# EasyEDA Pro project FOX_HTOL_test_2.0.eprj

# Schematic Schematic1
Create Date: 2023-11-06; Page Name: P1; Project Name: FOX_HTOL_test_2.0; Schematic Name: Schematic1; Update Date: 2023-11-07; Company: 嘉立创EDA; Page Size: A4; Version: V1.0
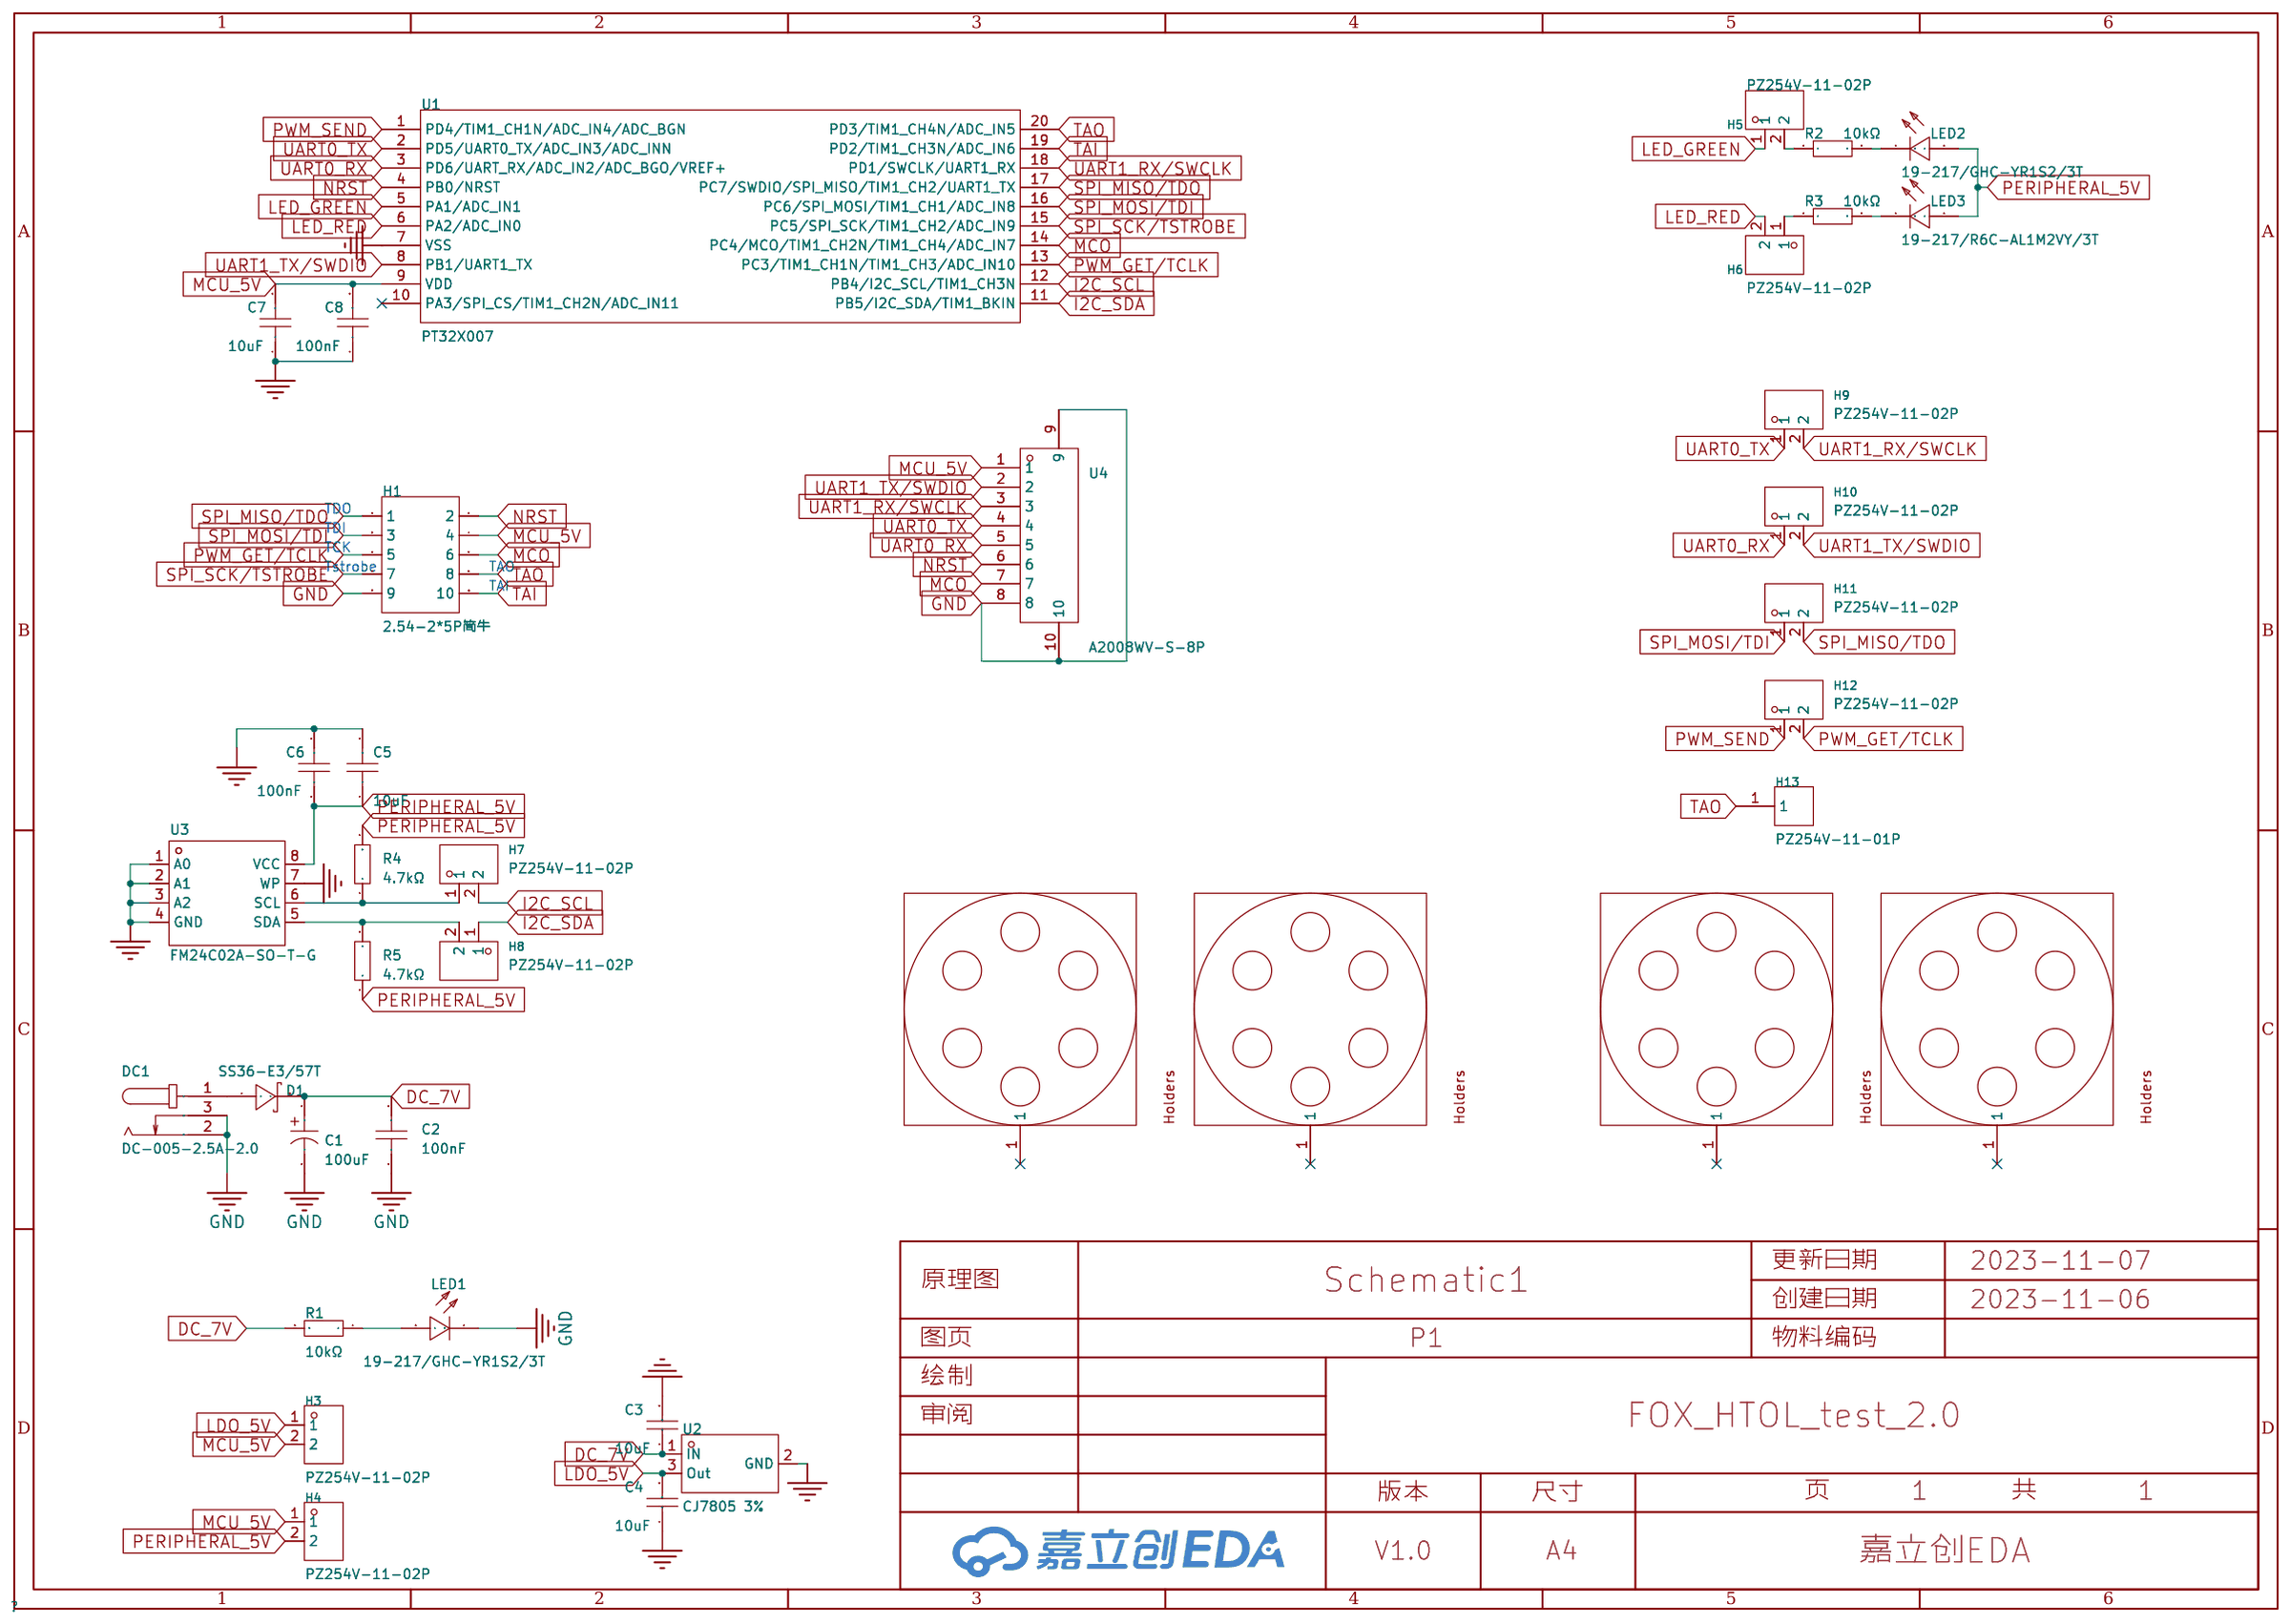
[diagram p0: schematic sheet]

## Parts
C1  100uF  [CAP-SMD_BD6.3-L6.6-W6.6-LS7.6-FD-1]
C2  100nF  [C0603]
C3  10uF  [C1206]
C4  10uF  [C1206]
C5  10uF  [C0603]
C6  100nF  [C0603]
C7  10uF  [C0603]
C8  100nF  [C0603]
D1  SS36-E3/57T  [SMC_L7.1-W6.2-LS8.1-R-RD]
DC1  DC-005-2.5A-2.0  [CONN-TH_DC-005-2.5A-2.0]
H1  2.54-2*5P简牛  [IDC-TH_10P-P2.54_C5665]
H3  PZ254V-11-02P  [HDR-TH_2P-P2.54-V-M]
H4  PZ254V-11-02P  [HDR-TH_2P-P2.54-V-M]
H5  PZ254V-11-02P  [HDR-TH_2P-P2.54-V-M]
H6  PZ254V-11-02P  [HDR-TH_2P-P2.54-V-M]
H7  PZ254V-11-02P  [HDR-TH_2P-P2.54-V-M]
H8  PZ254V-11-02P  [HDR-TH_2P-P2.54-V-M]
H9  PZ254V-11-02P  [HDR-TH_2P-P2.54-V-M]
H10  PZ254V-11-02P  [HDR-TH_2P-P2.54-V-M]
H11  PZ254V-11-02P  [HDR-TH_2P-P2.54-V-M]
H12  PZ254V-11-02P  [HDR-TH_2P-P2.54-V-M]
H13  PZ254V-11-01P  [HDR-TH_1P-P2.54-V-M]
J2  -  [DEMO板安装孔]
J3  -  [DEMO板安装孔]
J4  -  [DEMO板安装孔]
J5  -  [DEMO板安装孔]
LED1  19-217/GHC-YR1S2/3T  [LED0603-RD]
LED2  19-217/GHC-YR1S2/3T  [LED0603-RD]
LED3  19-217/R6C-AL1M2VY/3T  [LED0603-RD]
R1  10kΩ  [R0603]
R2  10kΩ  [R0603]
R3  10kΩ  [R0603]
R4  4.7kΩ  [R0603]
R5  4.7kΩ  [R0603]
U1  PT32X007  [TSSOP-20_L6.5-W4.4-P0.65-LS6.4-BL]
U2  CJ7805 3%  [TO-252-2_L6.6-W6.1-P4.58-LS10.1-BR-CW]
U3  FM24C02A-SO-T-G  [SOP-8_L5.0-W4.0-P1.27-LS6.2-BL]
U4  A2008WV-S-8P  [CONN-SMD_A2008WV-S-8P]

## Library data of the parts
C1 = RVE100UF35V67RV0072: 容值:100uF;额定电压:35V;电容体直径:-;电容体长度:-;纹波电流:-;等效串联电阻:-;工作寿命:-;; LCSC Part Name: 100uF 35V; Supplier Part: C2836437; Manufacturer: KNSCHA(科尼盛); Supplier Footprint: SMD,6.3x7.7mm; JLCPCB Part Class: Extended Part; Datasheet: https://atta.szlcsc.com/upload/public/pdf/source/20220719/B52EB46F8A1558448ED03D8B4CB3C24F.pdf; Supplier: LCSC; Rated Voltage: 35V
C2 = CL10B104KB8NNNC: 容值:100nF;精度:±10%;额定电压:50V;材质(温度系数):X7R;; LCSC Part Name: 100nF ±10% 50V; Supplier Part: C1591; Manufacturer: SAMSUNG(三星); Supplier Footprint: 0603; JLCPCB Part Class: Extended Part; Datasheet: https://atta.szlcsc.com/upload/public/pdf/source/20160103/1457707680512.pdf; Supplier: LCSC; Tolerance: ±10%; Voltage Rated: 50V; Temperature Coefficient: X7R
C3 C4 = CL31A106KBHNNNE: 容值:10uF;精度:±10%;额定电压:50V;材质(温度系数):X5R;; LCSC Part Name: 10uF ±10% 50V; Supplier Part: C13585; Manufacturer: SAMSUNG(三星); Supplier Footprint: 1206; JLCPCB Part Class: Basic Part; Datasheet: https://atta.szlcsc.com/upload/public/pdf/source/20160103/1457707668742.pdf; Supplier: LCSC; Tolerance: ±10%; Voltage Rated: 50V; Temperature Coefficient: X5R
C5 C7 = CL10A106MA8NRNC: 容值:10uF;精度:±20%;额定电压:25V;材质(温度系数):X5R;; LCSC Part Name: 10uF ±20% 25V; Supplier Part: C96446; Manufacturer: SAMSUNG(三星); Supplier Footprint: 0603; JLCPCB Part Class: Basic Part; Datasheet: https://atta.szlcsc.com/upload/public/pdf/source/20170325/1490427913016.pdf; Supplier: LCSC; Tolerance: ±20%; Voltage Rated: 25V; Temperature Coefficient: X5R
C6 C8 = CC0603KRX7R9BB104: 容值:100nF;精度:±10%;额定电压:50V;材质(温度系数):X7R;; LCSC Part Name: 100nF ±10% 50V; Supplier Part: C14663; Manufacturer: YAGEO(国巨); Supplier Footprint: 0603; JLCPCB Part Class: Basic Part; Datasheet: https://atta.szlcsc.com/upload/public/pdf/source/20180910/C282072_33301C7F631E79921B82A8DAC6BCC5B3.pdf; Supplier: LCSC; Tolerance: ±10%; Voltage Rated: 50V; Temperature Coefficient: X7R
D1 = SS36-E3/57T: 直流反向耐压（Vr）:60V;平均整流电流（Io）:3A;正向压降（Vf）:750mV @ 3A;; Supplier Part: C35722; Manufacturer: VISHAY(威世); Supplier Footprint: SMC(DO-214AB); JLCPCB Part Class: Basic Part; Datasheet: https://atta.szlcsc.com/upload/public/pdf/source/20151007/1457707426323.pdf; Supplier: LCSC
DC1 = DC-005-2.5A-2.0: 连接器类型:DC电源插座;安装方式:面板安装;触点内径:2mm;触点外径:6.2mm;额定电流:2.5A;额定电压:24V;触头材质:黄铜;工作温度范围:-20℃~+70℃;焊接温度(最大值):260℃;; LCSC Part Name: DC电源插座 内径:2mm 外径:6.2mm; Supplier Part: C319099; Manufacturer: XKB Connectivity(中国星坤); Supplier Footprint: 插件; JLCPCB Part Class: Extended Part; Datasheet: https://atta.szlcsc.com/upload/public/pdf/source/20230410/3C172F25A51FCA230ABE6D36425CBB3B.pdf; Supplier: LCSC; Connector Type: DC电源插座; Mounting Style: 面板安装; Inside Contact Diameter: 2mm; Outside Contact Diameter: 6.2mm; Current Rating (Max): 2.5A; Voltage Rating (Max): 24V; Contact Material: 黄铜; Operating Temperature Range: -20℃~+70℃; Welding Temperature (Max): 260℃
H1 = 2.54-2*5P简牛: 连接器类型:简牛座;每排PIN数:5;排数:2;间距:2.54mm;行距:2.54mm;封装形式:直插;触头材质:-;触头镀层:-;; LCSC Part Name: 每排P数:5 排数:2 2.54mm; Supplier Part: C5665; Manufacturer: BOOMELE(博穆精密); Supplier Footprint: 插件,P=2.54mm; JLCPCB Part Class: Extended Part; Datasheet: https://atta.szlcsc.com/upload/public/pdf/source/20140331/1457707037896.pdf; Supplier: LCSC; Connector Type: 简牛座; Pin Number in each Row: 5; Number of Rows: 2; Pitch: 2.54mm; Row Spacing: 2.54mm; Holder Type: 直插
H3-H12 = PZ254V-11-02P: 排数:单排;总PIN位数:2P;间距:2.54mm;插针结构:1x2P;行距:-;安装类型:直插;圆针/方针:方针;额定电流:-;额定电压:-;配合针长度:6mm;塑高:2.5mm;端接针长度:3mm;触头材质:黄铜;触头镀层:-;工作温度范围:-40℃~+105℃;颜色:黑色;; LCSC Part Name: 2.54mm 1x2P 直插 方针; Supplier Part: C492401; Manufacturer: XFCN(兴飞); Supplier Footprint: 插件,P=2.54mm; JLCPCB Part Class: Extended Part; Datasheet: https://atta.szlcsc.com/upload/public/pdf/source/20200309/C492401_A812433581A9B211A7FFA413ADDFF0E5.pdf; Supplier: LCSC; Number of Rows: 单排; Number of Pins: 2P; Pitch: 2.54mm; Pin Structure: 1x2P; Mounting Type: 直插; Circluar Pins/Square Pins: 方针; Length of Mating Pin: 6mm; Insulation Height: 2.5mm; Length of End Connection Pin: 3mm; Contact Material: 黄铜; Operating Temperature Range: -40℃~+105℃; Color: 黑色
H13 = PZ254V-11-01P: 排数:单排;总PIN位数:1P;间距:2.54mm;插针结构:1x1P;行距:-;安装类型:直插;圆针/方针:方针;额定电流:-;额定电压:-;配合针长度:6mm;塑高:2.5mm;端接针长度:3mm;触头材质:黄铜;触头镀层:-;工作温度范围:-40℃~+105℃;颜色:黑色;; LCSC Part Name: 2.54mm 1x1P 直插 方针; Supplier Part: C492400; Manufacturer: XFCN(兴飞); Supplier Footprint: 插件,P=2.54mm; JLCPCB Part Class: Extended Part; Datasheet: https://atta.szlcsc.com/upload/public/pdf/source/20200309/C492400_46876A5B545F5AE6B8D4A09C46E276E8.pdf; Supplier: LCSC; Number of Rows: 单排; Number of Pins: 1P; Pitch: 2.54mm; Pin Structure: 1x1P; Mounting Type: 直插; Circluar Pins/Square Pins: 方针; Length of Mating Pin: 6mm; Insulation Height: 2.5mm; Length of End Connection Pin: 3mm; Contact Material: 黄铜; Operating Temperature Range: -40℃~+105℃; Color: 黑色
J2-J5 = 螺孔_3.1X6MM
LED1 LED2 = 19-217/GHC-YR1S2/3T: 发光颜色:翠绿;二极管配置:-;透镜颜色:无色透明;主波长:520nm~535nm;峰值波长:518nm;色温:-;测试电流:20mA;功率:110mW;发光角度:120°;安装方式:-;工作温度:-40℃~+85℃;; LCSC Part Name: 翠绿 520nm~535nm; Supplier Part: C72043; Manufacturer: EVERLIGHT(亿光); Supplier Footprint: 0603; JLCPCB Part Class: Basic Part; Datasheet: https://atta.szlcsc.com/upload/public/pdf/source/20160507/1462613613780.pdf; Supplier: LCSC; Emitted Color: 翠绿; Lens Color: 无色透明; Dominant Wavelength: 520nm~535nm; Peak Wavelength: 518nm; Forward Current: 20mA; Power Dissipation: 110mW; Viewing Angle: 120°; Operating Temperature: -40℃~+85℃
LED3 = 19-217/R6C-AL1M2VY/3T: 发光颜色:红灯;二极管配置:-;透镜颜色:无色透明;主波长:617.5nm;色温:-;功率:60mW;发光角度:120°;安装方式:-;工作温度:-40℃~+85℃;; LCSC Part Name: 红灯 停产; Supplier Part: C72044; Manufacturer: EVERLIGHT(亿光); Supplier Footprint: 0603; JLCPCB Part Class: Extended Part; Datasheet: https://atta.szlcsc.com/upload/public/pdf/source/20160507/1462613613821.pdf; Supplier: LCSC; Emitted Color: 红灯; Lens Color: 无色透明; Dominant Wavelength: 617.5nm; Peak Wavelength: 632nm; Forward Current: 5mA; Forward Voltage (VF): 1.95V; Power Dissipation: 60mW; Viewing Angle: 120°; Operating Temperature: -40℃~+85℃
R1 = 0603WAF1002T5E: 电阻类型:厚膜电阻;阻值:10kΩ;精度:±1%;功率:100mW;温度系数:±100ppm/℃;最大工作电压:75V;工作温度范围:-55℃~+155℃;; LCSC Part Name: 10kΩ ±1% 100mW; Supplier Part: C25804; Manufacturer: UNI-ROYAL(厚声); Supplier Footprint: 0603; JLCPCB Part Class: Basic Part; Datasheet: https://atta.szlcsc.com/upload/public/pdf/source/20200306/C422600_1E6D84923E4A46A82E41ADD87F860B5C.pdf; Supplier: LCSC; Type: 厚膜电阻; Tolerance: ±1%; Power(Watts): 100mW; Temperature Coefficient: ±100ppm/℃; Overload Voltage (Max): 75V; Operating Temperature Range: -55℃~+155℃
R2 R3 = 0603WAF1002T5E: 电阻类型:厚膜电阻;阻值:10kΩ;精度:±1%;功率:100mW;; LCSC Part Name: 10kΩ ±1% 100mW; Supplier Part: C25804; Manufacturer: UNI-ROYAL(厚声); Supplier Footprint: 0603; JLCPCB Part Class: Basic Part; Datasheet: https://atta.szlcsc.com/upload/public/pdf/source/20200306/C422600_1E6D84923E4A46A82E41ADD87F860B5C.pdf; Supplier: LCSC; Type: 厚膜电阻; Tolerance: ±1%; Power(Watts): 100mW; Temperature Coefficient: ±100ppm/℃; Overload Voltage (Max): 75V; Operating Temperature Range: -55℃~+155℃
R4 R5 = 0603WAF4701T5E: 电阻类型:厚膜电阻;阻值:4.7kΩ;精度:±1%;功率:100mW;温度系数:±100ppm/℃;; LCSC Part Name: 厚膜电阻 4.7kΩ ±1% 100mW; Supplier Part: C23162; Manufacturer: UNI-ROYAL(厚声); Supplier Footprint: 0603; JLCPCB Part Class: Basic Part; Datasheet: https://atta.szlcsc.com/upload/public/pdf/source/20200306/C422600_1E6D84923E4A46A82E41ADD87F860B5C.pdf; Supplier: LCSC; Type: 厚膜电阻; Tolerance: ±1%; Power(Watts): 100mW; Temperature Coefficient: ±100ppm/℃; Overload Voltage (Max): 75V; Operating Temperature Range: -55℃~+155℃
U1 = PT32X007
U2 = CJ7805 3%: 输出类型:固定;输出极性:正;最大输入电压:35V;输出电压:5V;输出电流:1.5A;; LCSC Part Name: 3%; Supplier Part: C21706; Manufacturer: CJ(江苏长电/长晶); Supplier Footprint: TO-252-2(DPAK); JLCPCB Part Class: Extended Part; Datasheet: https://atta.szlcsc.com/upload/public/pdf/source/20171106/C21706_15099535628491092916.pdf; Supplier: LCSC; Output Type: 固定; Output Polarity: 正; Number of Outputs: 1; Maximum Input Voltage: 35V; Output Voltage: 5V; Dropout Voltage: 2V@(1A); Output Current: 1.5A
U3 = FM24C02A-SO-T-G: 2-Kbit(256 x 8bit)，I2C接口，工作电压：1.7V to 5.5V; Supplier Part: C9997; Manufacturer: FM(复旦微); Supplier Footprint: SOP-8; JLCPCB Part Class: Extended Part; Datasheet: https://atta.szlcsc.com/upload/public/pdf/source/20140226/1457706994856.pdf; Supplier: LCSC
U4 = A2008WV-S-8P: 参考系列:PH;间距:2mm;插针结构:1x8P;排数:1;每排PIN数:8;行距:-;安装方式:-;触头材质:黄铜;; LCSC Part Name: PH 2mm 1x8P 镀锡; Supplier Part: C273128; Manufacturer: CJT(长江连接器); Supplier Footprint: SMD,P=2mm; JLCPCB Part Class: Extended Part; Datasheet: https://atta.szlcsc.com/upload/public/pdf/source/20180913/C273128_BB1852F7672CD820F7AD4E26555E7BEC.pdf; Supplier: LCSC; Reference Series: PH; Pitch: 2mm; Pins Structure: 1x8P; Number of Rows: 1; Number of PINs Per Row: 8; Contact Material: 黄铜

## Nets
GND: C1.2 C2.1 C3.2 C4.1 C5.2 C6.2 C7.1 C8.1 DC1.2 DC1.3 H1.9 LED1.1(C) U1.7(VSS) U2.2(GND) U3.1(A0) U3.2(A1) U3.3(A2) U3.4(GND) U3.7(WP) U4.8 U4.9 U4.10
DC_7V: C1.1 C2.2 C3.1 D1.2(K) R1.2 U2.1(IN)
I2C_SCL: H7.2 U1.12(PB4/I2C_SCL/TIM1_CH3N)
I2C_SDA: H8.1 U1.11(PB5/I2C_SDA/TIM1_BKIN)
LDO_5V: C4.2 H3.1 U2.3(Out)
LED_GREEN: H5.1 U1.5(PA1/ADC_IN1)
LED_RED: H6.2 U1.6(PA2/ADC_IN0)
MCO: H1.6 U1.14(PC4/MCO/TIM1_CH2N/TIM1_CH4/ADC_IN7) U4.7
MCU_5V: C7.2 C8.2 H1.4 H3.2 H4.1 U1.9(VDD) U4.1
NRST: H1.2 U1.4(PB0/NRST) U4.6
PERIPHERAL_5V: C5.1 C6.1 H4.2 LED2.2(A) LED3.2(A) R4.2 R5.1 U3.8(VCC)
PWM_GET/TCLK: H1.5 H12.2 U1.13(PC3/TIM1_CH1N/TIM1_CH3/ADC_IN10)
PWM_SEND: H12.1 U1.1(PD4/TIM1_CH1N/ADC_IN4/ADC_BGN)
SPI_MISO/TDO: H1.1 H11.2 U1.17(PC7/SWDIO/SPI_MISO/TIM1_CH2/UART1_TX)
SPI_MOSI/TDI: H1.3 H11.1 U1.16(PC6/SPI_MOSI/TIM1_CH1/ADC_IN8)
SPI_SCK/TSTROBE: H1.7 U1.15(PC5/SPI_SCK/TIM1_CH2/ADC_IN9)
TAI: H1.10 U1.19(PD2/TIM1_CH3N/ADC_IN6)
TAO: H1.8 H13.1 U1.20(PD3/TIM1_CH4N/ADC_IN5)
UART0_RX: H10.1 U1.3(PD6/UART_RX/ADC_IN2/ADC_BGO/VREF+) U4.5
UART0_TX: H9.1 U1.2(PD5/UART0_TX/ADC_IN3/ADC_INN) U4.4
UART1_RX/SWCLK: H9.2 U1.18(PD1/SWCLK/UART1_RX) U4.3
UART1_TX/SWDIO: H10.2 U1.8(PB1/UART1_TX) U4.2
$1N831: D1.1(A) DC1.1
$1N1246: LED1.2(A) R1.1
$1N1959: H5.2 R2.1
$1N1962: H6.1 R3.1
$1N1965: LED2.1(C) R2.2
$1N1968: LED3.1(C) R3.2
$1N2989: H7.1 R4.1 U3.6(SCL)
$1N3006: H8.2 R5.2 U3.5(SDA)

Not connected (* = marked no-connect by the designer): J2 1*; J3 1*; J4 1*; J5 1*; U1 10(PA3/SPI_CS/TIM1_CH2N/ADC_IN11)*

## Notes on the sheet
- TDO
- TDI
- TCK
- Tstrobe
- TAI
- TAO

# Board PCB1
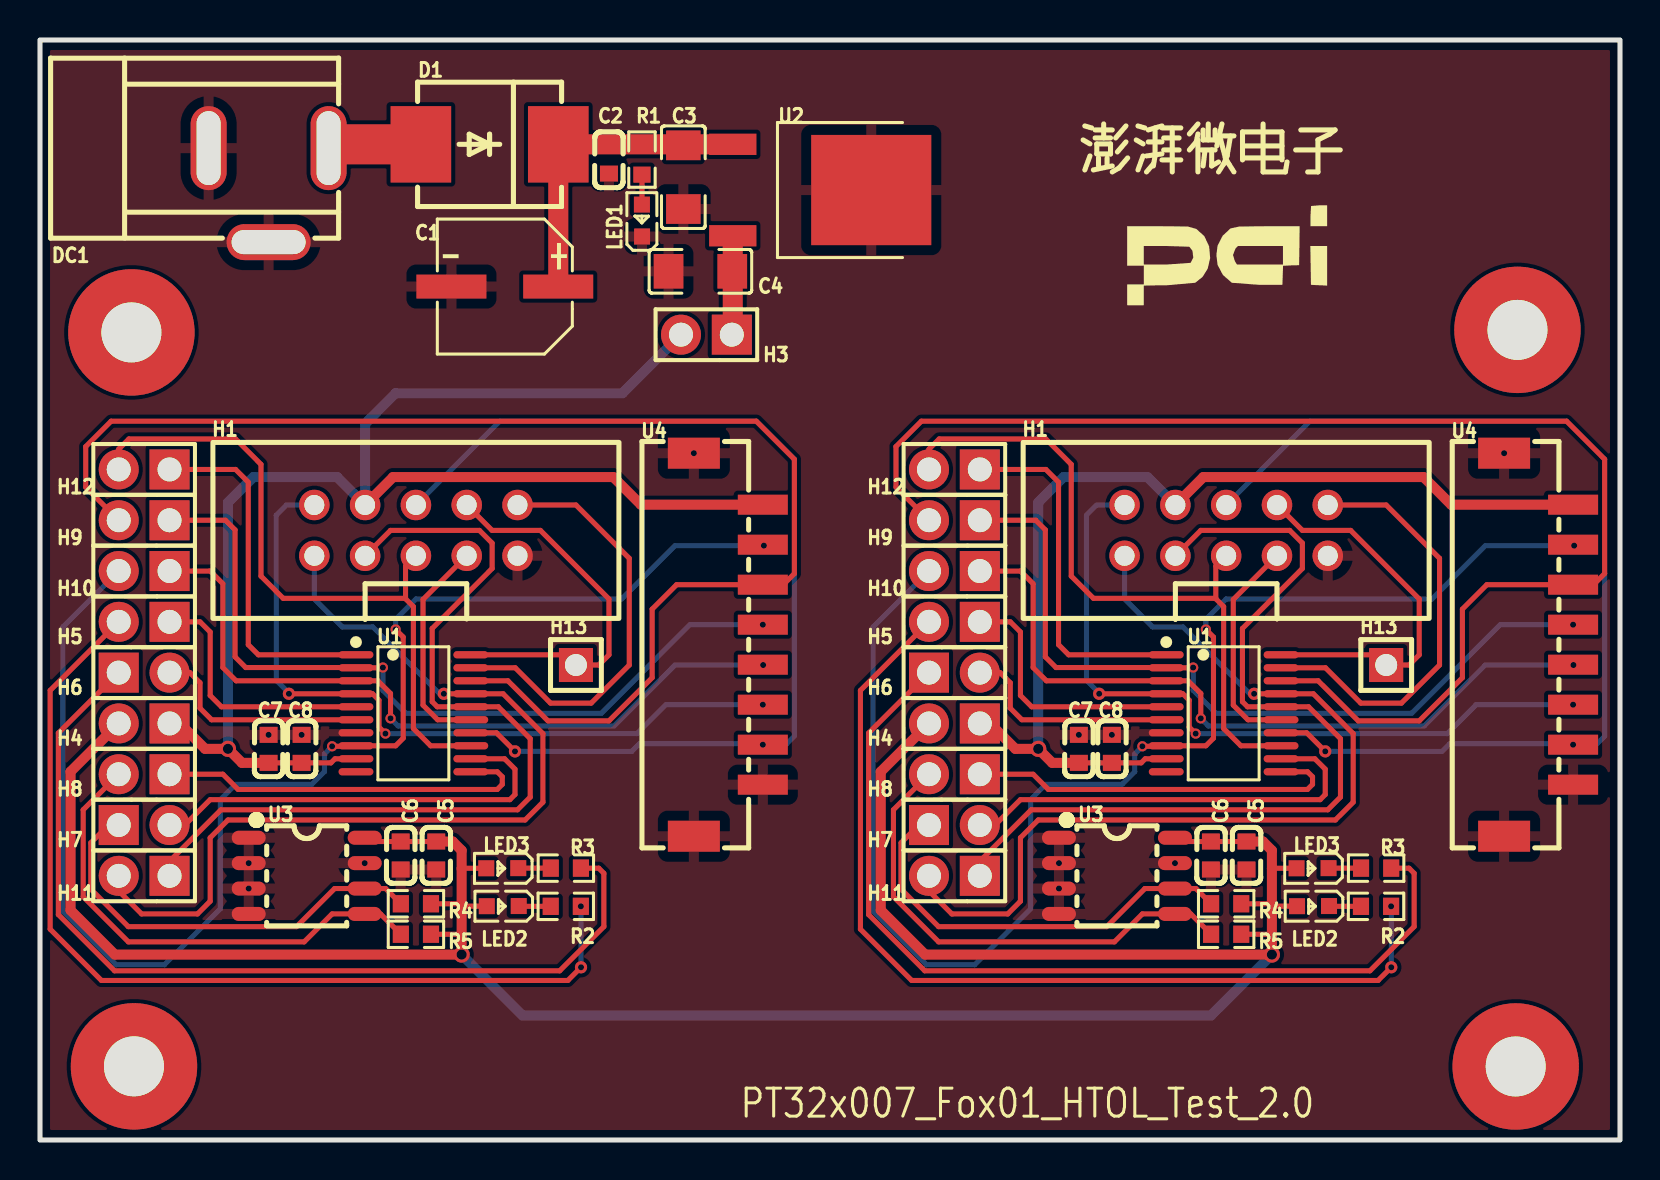
[diagram p1: board, top side]
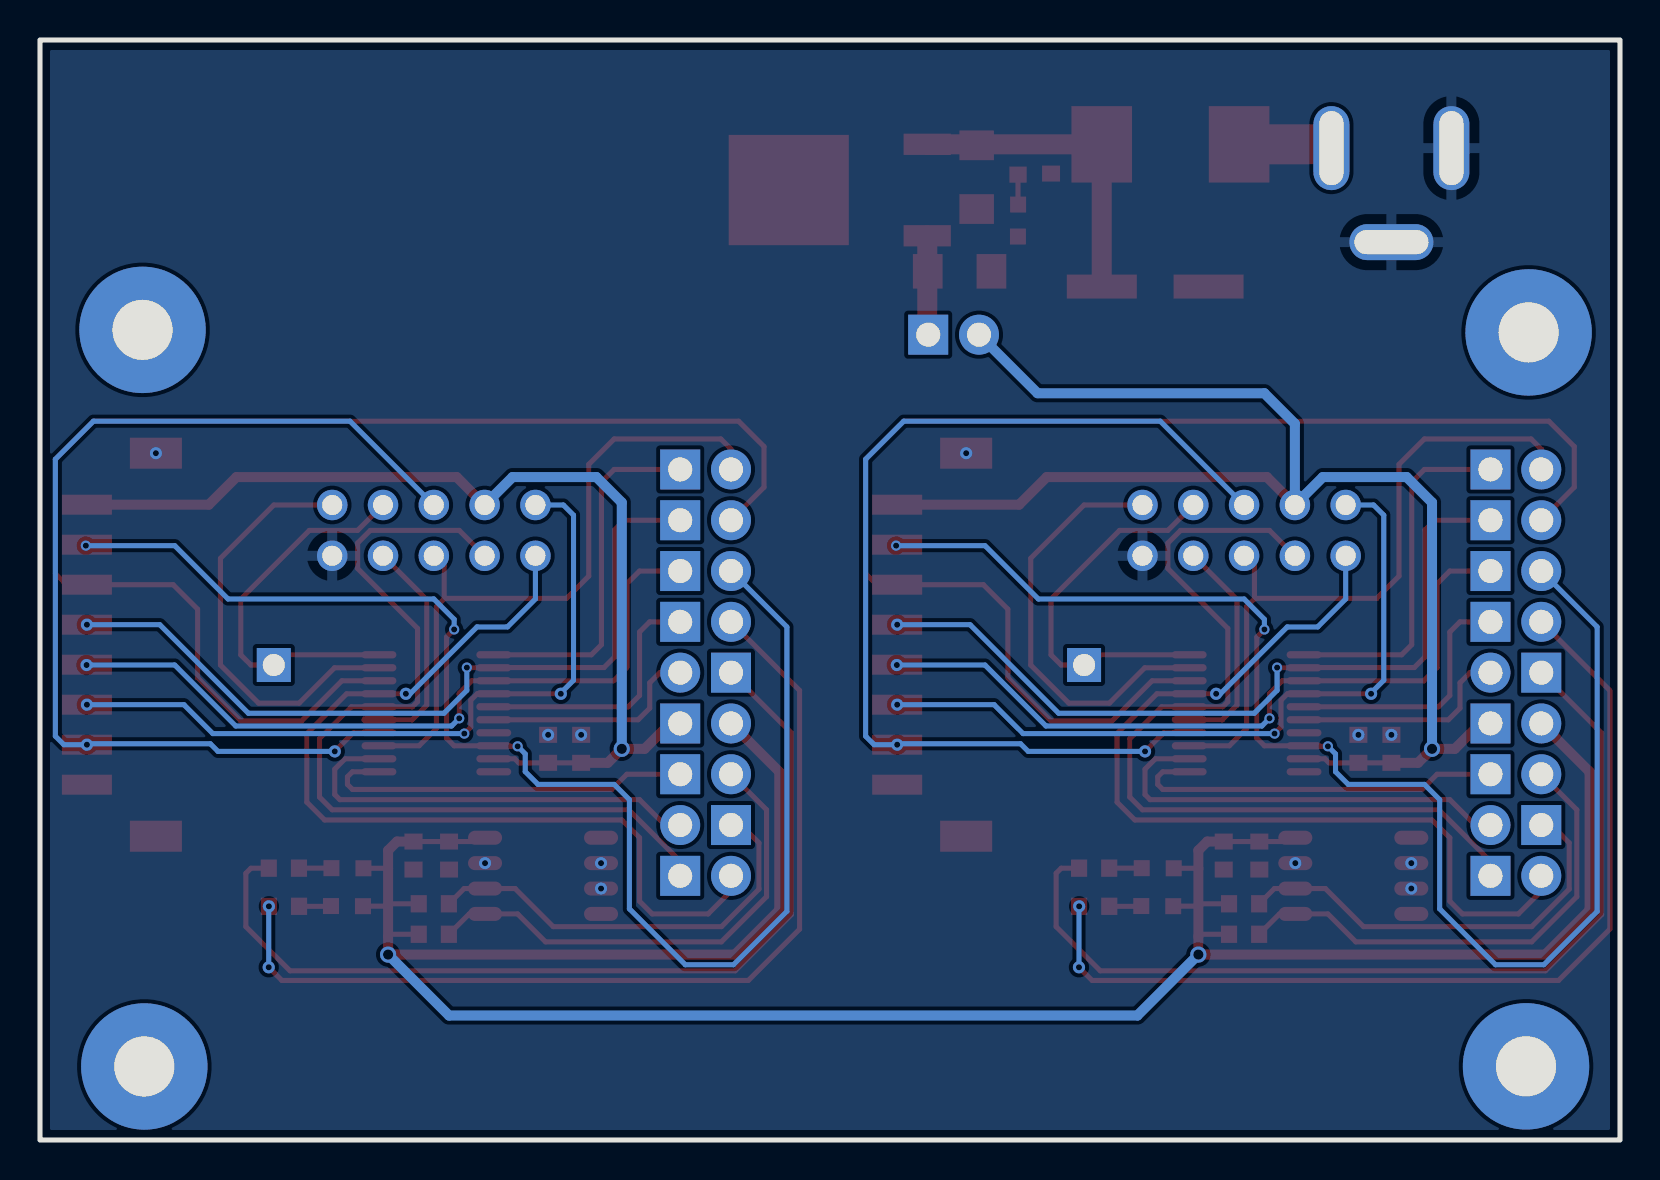
[diagram p2: board, bottom side, seen from below]

Outline 79 x 55 mm; copper layers: Top Layer, Bottom Layer. Coordinates in mm from the lower left corner of the outline.
Outline path: rectangle 0,55 79,0
Stack: Top Layer 0.035mm / Dielectric1 1.51mm FR4 er 4.5 / Bottom Layer 0.035mm

## Design rules (mm)
template: 自定义配置
spacing copperThickness1oz (default): track to track 0.102, other pairs 0.152 to 0.3
spacing copperThickness2oz: track to track 0.203, other pairs 0.152 to 0.3
track width copperThickness1oz (default): min 0.127, default 0.254, max 2.54
track width copperThickness2oz: min 0.203, default 0.254, max 2.54
differential pair differentialPair (default): width min 0.127, default 0.254, max 2.54; gap min 0.152, default 0.152
via viaSize (default): diameter min 0.5, default 0.61, max 10; hole min 0.3, default 0.305, max 6.3

## Placement (name value [footprint] x y rotation side)
C1  100uF  [CAP-SMD_BD6.3-L6.6-W6.6-LS7.6-FD-1]  23.24 42.67 180 top
C2  100nF  [C0603]  28.45 49.02 90 top
C3  10uF  [C1206]  32.17 48.14 270 top
C4  10uF  [C1206]  33.02 43.43 0 top
C5  10uF  [C0603]  19.81 14.22 270 top
C5#2  -  [C0603]  60.33 14.22 270 top
C6  100nF  [C0603]  18.03 14.22 270 top
C6#2  -  [C0603]  58.55 14.22 270 top
C7  10uF  [C0603]  51.94 19.56 270 top
C7#2  -  [C0603]  11.43 19.56 270 top
C8  100nF  [C0603]  53.59 19.56 270 top
C8#2  -  [C0603]  13.08 19.56 270 top
D1  SS36-E3/57T  [SMC_L7.1-W6.2-LS8.1-R-RD]  22.48 49.78 180 top
DC1  DC-005-2.5A-2.0  [CONN-TH_DC-005-2.5A-2.0]  11.43 47.24 0 top
H1  2.54-2*5P简牛  [IDC-TH_10P-P2.54_C5665]  59.31 30.48 0 top
H1#2  -  [IDC-TH_10P-P2.54_C5665]  18.8 30.48 0 top
H3  PZ254V-11-02P  [HDR-TH_2P-P2.54-V-M]  33.32 40.27 180 top
H4  PZ254V-11-02P  [HDR-TH_2P-P2.54-V-M]  45.72 20.83 180 top
H4#2  -  [HDR-TH_2P-P2.54-V-M]  5.21 20.83 180 top
H5  PZ254V-11-02P  [HDR-TH_2P-P2.54-V-M]  45.72 25.91 180 top
H5#2  -  [HDR-TH_2P-P2.54-V-M]  5.21 25.91 180 top
H6  PZ254V-11-02P  [HDR-TH_2P-P2.54-V-M]  45.72 23.37 0 top
H6#2  -  [HDR-TH_2P-P2.54-V-M]  5.21 23.37 0 top
H7  PZ254V-11-02P  [HDR-TH_2P-P2.54-V-M]  45.72 15.75 0 top
H7#2  -  [HDR-TH_2P-P2.54-V-M]  5.21 15.75 0 top
H8  PZ254V-11-02P  [HDR-TH_2P-P2.54-V-M]  45.72 18.29 180 top
H8#2  -  [HDR-TH_2P-P2.54-V-M]  5.21 18.29 180 top
H9  PZ254V-11-02P  [HDR-TH_2P-P2.54-V-M]  5.21 30.99 180 top
H9#2  -  [HDR-TH_2P-P2.54-V-M]  45.72 30.99 180 top
H10  PZ254V-11-02P  [HDR-TH_2P-P2.54-V-M]  5.21 28.45 180 top
H10#2  -  [HDR-TH_2P-P2.54-V-M]  45.72 28.45 180 top
H11  PZ254V-11-02P  [HDR-TH_2P-P2.54-V-M]  45.72 13.21 180 top
H11#2  -  [HDR-TH_2P-P2.54-V-M]  5.21 13.21 180 top
H12  PZ254V-11-02P  [HDR-TH_2P-P2.54-V-M]  45.72 33.53 180 top
H12#2  -  [HDR-TH_2P-P2.54-V-M]  5.21 33.53 180 top
H13  PZ254V-11-01P  [HDR-TH_1P-P2.54-V-M]  67.31 23.75 0 top
H13#2  -  [HDR-TH_1P-P2.54-V-M]  26.8 23.75 0 top
J2  -  [DEMO板安装孔]  73.87 40.51 0 top
J3  -  [DEMO板安装孔]  4.57 40.38 0 top
J4  -  [DEMO板安装孔]  73.79 3.68 0 top
J5  -  [DEMO板安装孔]  4.7 3.68 0 top
LED1  19-217/GHC-YR1S2/3T  [LED0603-RD]  30.1 45.97 90 top
LED2  19-217/GHC-YR1S2/3T  [LED0603-RD]  23.14 11.69 180 top
LED2#2  -  [LED0603-RD]  63.65 11.69 180 top
LED3  19-217/R6C-AL1M2VY/3T  [LED0603-RD]  23.11 13.59 180 top
LED3#2  -  [LED0603-RD]  63.63 13.59 180 top
R1  10kΩ  [R0603]  30.1 49.02 90 top
R2  10kΩ  [R0603]  26.29 11.68 180 top
R2#2  -  [R0603]  66.8 11.68 180 top
R3  10kΩ  [R0603]  26.29 13.59 180 top
R3#2  -  [R0603]  66.81 13.59 180 top
R4  4.7kΩ  [R0603]  59.31 11.81 0 top
R4#2  -  [R0603]  18.8 11.81 0 top
R5  4.7kΩ  [R0603]  18.8 10.29 180 top
R5#2  -  [R0603]  59.31 10.29 180 top
U1  PT32X007  [TSSOP-20_L6.5-W4.4-P0.65-LS6.4-BL]  18.67 21.34 270 top
U1#2  -  [TSSOP-20_L6.5-W4.4-P0.65-LS6.4-BL]  59.18 21.34 270 top
U2  CJ7805 3%  [TO-252-2_L6.6-W6.1-P4.58-LS10.1-BR-CW]  38.1 47.5 180 top
U3  FM24C02A-SO-T-G  [SOP-8_L5.0-W4.0-P1.27-LS6.2-BL]  13.34 13.21 270 top
U3#2  -  [SOP-8_L5.0-W4.0-P1.27-LS6.2-BL]  53.85 13.21 270 top
U4  A2008WV-S-8P  [CONN-SMD_A2008WV-S-8P]  74.93 24.77 270 top
U4#2  -  [CONN-SMD_A2008WV-S-8P]  34.42 24.77 270 top

## Footprints (pads in the part's own frame, mm; a bottom-side part is the same pattern mirrored in y, then rotated)
C0603
  rect 0.8x0.9 smd: 1(-0.7,0) 2(0.7,0)
C1206
  rect 1.485x1.728 smd: 1(-1.593,0) 2(1.593,0)
CAP-SMD_BD6.3-L6.6-W6.6-LS7.6-FD-1
  rect 3.5x1.2 smd: 1(-2.67,0) 2(2.67,0)
CONN-SMD_A2008WV-S-8P
  rect 1x2.5 smd: 1(-7,1.724) 2(-5,1.724) 3(-3,1.724) 4(-1,1.724) 5(1,1.724) 6(2.999,1.724) 7(5,1.724) 8(7,1.724)
  rect 1.55x2.6 smd: 9(-9.575,-1.724) 10(9.575,-1.724)
CONN-TH_DC-005-2.5A-2.0
  oval 1.8x4.2 hole 1.2x3.7: 1(2.999,2.35) 2(-2.999,2.35)
  oval 4.2x1.8 hole 3.7x1.2: 3(0,-2.35)
DEMO板安装孔
  round 6.32 hole 3: 1(0,0)
HDR-TH_1P-P2.54-V-M
  rect 1.7x1.7 hole 1.1: 1(0,0)
HDR-TH_2P-P2.54-V-M
  rect 2x2 hole 1.2: 1(-1.27,0)
  round 2 hole 1.2: 2(1.27,0)
IDC-TH_10P-P2.54_C5665
  round 1.524 hole 1: 1(-5.08,-1.27) 2(-5.08,1.27) 3(-2.54,-1.27) 4(-2.54,1.27) 5(0,-1.27) 6(0,1.27) 7(2.54,-1.27) 8(2.54,1.27) 9(5.08,-1.27) 10(5.08,1.27)
LED0603-RD
  rect 0.8x0.8 smd: 1(-0.799,-0.004) 2(0.799,0.004)
R0603
  rect 0.806x0.864 smd: 1(-0.753,0) 2(0.753,0)
SMC_L7.1-W6.2-LS8.1-R-RD
  rect 3.03x3.82 smd: 1(3.435,0) 2(-3.435,0)
SOP-8_L5.0-W4.0-P1.27-LS6.2-BL
  oval 0.7x1.7 smd: 1(-1.905,-2.9) 2(-0.635,-2.9) 3(0.635,-2.9) 4(1.905,-2.9) 5(1.905,2.9) 6(0.635,2.9) 7(-0.635,2.9) 8(-1.905,2.9)
TO-252-2_L6.6-W6.1-P4.58-LS10.1-BR-CW
  rect 2.364x1.064 smd: 1(3.462,-2.286) 3(3.462,2.286)
  rect 6.004x5.512 smd: 2(-3.462,0)
TSSOP-20_L6.5-W4.4-P0.65-LS6.4-BL
  oval 0.364x1.742 smd: 1(-2.925,-2.871) 2(-2.275,-2.871) 3(-1.625,-2.871) 4(-0.975,-2.871) 5(-0.325,-2.871) 6(0.325,-2.871) 7(0.975,-2.871) 8(1.625,-2.871) 9(2.275,-2.871) 10(2.925,-2.871) 11(2.925,2.871) 12(2.275,2.871) 13(1.625,2.871) 14(0.975,2.871) 15(0.325,2.871) 16(-0.325,2.871) 17(-0.975,2.871) 18(-1.625,2.871) 19(-2.275,2.871) 20(-2.925,2.871)

## Nets
GND: C1.2 C2.1 C3.2 C4.1 C5.2 C5#2.2 C6.2 C6#2.2 C7.1 C7#2.1 C8.1 C8#2.1 DC1.2 DC1.3 H1.9 H1#2.9 LED1.1 U1.7 U1#2.7 U2.2 U3.1 U3.2 U3.3 U3.4 U3.7 U3#2.1 U3#2.2 U3#2.3 U3#2.4 U3#2.7 U4.8 U4.9 U4.10 U4#2.8 U4#2.9 U4#2.10
DC_7V: C1.1 C2.2 C3.1 D1.2 R1.2 U2.1
I2C_SCL: H7.2 H7#2.2 U1.12 U1#2.12
I2C_SDA: H8.1 H8#2.1 U1.11 U1#2.11
LDO_5V: C4.2 H3.1 U2.3
LED_GREEN: H5.1 H5#2.1 U1.5 U1#2.5
LED_RED: H6.2 H6#2.2 U1.6 U1#2.6
MCO: H1.6 H1#2.6 U1.14 U1#2.14 U4.7 U4#2.7
MCU_5V: C7.2 C7#2.2 C8.2 C8#2.2 H1.4 H1#2.4 H3.2 H4.1 H4#2.1 U1.9 U1#2.9 U4.1 U4#2.1
NRST: H1.2 H1#2.2 U1.4 U1#2.4 U4.6 U4#2.6
PERIPHERAL_5V: C5.1 C5#2.1 C6.1 C6#2.1 H4.2 H4#2.2 LED2.2 LED2#2.2 LED3.2 LED3#2.2 R4.2 R4#2.2 R5.1 R5#2.1 U3.8 U3#2.8
PWM_GET/TCLK: H1.5 H1#2.5 H12.2 H12#2.2 U1.13 U1#2.13
PWM_SEND: H12.1 H12#2.1 U1.1 U1#2.1
SPI_MISO/TDO: H1.1 H1#2.1 H11.2 H11#2.2 U1.17 U1#2.17
SPI_MOSI/TDI: H1.3 H1#2.3 H11.1 H11#2.1 U1.16 U1#2.16
SPI_SCK/TSTROBE: H1.7 H1#2.7 U1.15 U1#2.15
TAI: H1.10 H1#2.10 U1.19 U1#2.19
TAO: H1.8 H1#2.8 H13.1 H13#2.1 U1.20 U1#2.20
UART0_RX: H10.1 H10#2.1 U1.3 U1#2.3 U4.5 U4#2.5
UART0_TX: H9.1 H9#2.1 U1.2 U1#2.2 U4.4 U4#2.4
UART1_RX/SWCLK: H9.2 H9#2.2 U1.18 U1#2.18 U4.3 U4#2.3
UART1_TX/SWDIO: H10.2 H10#2.2 U1.8 U1#2.8 U4.2 U4#2.2
$1N831: D1.1 DC1.1
$1N1246: LED1.2 R1.1
$1N1959: H5.2 H5#2.2 R2.1 R2#2.1
$1N1962: H6.1 H6#2.1 R3.1 R3#2.1
$1N1965: LED2.1 LED2#2.1 R2.2 R2#2.2
$1N1968: LED3.1 LED3#2.1 R3.2 R3#2.2
$1N2989: H7.1 H7#2.1 R4.1 R4#2.1 U3.6 U3#2.6
$1N3006: H8.2 H8#2.2 R5.2 R5#2.2 U3.5 U3#2.5

Pads without a net: J2 1; J3 1; J4 1; J5 1; U1 10; U1#2 10

## Via types
v1: diameter 0.61, hole 0.305, Top Layer to Bottom Layer, 30 vias
v2: diameter 0.51, hole 0.305, Top Layer to Bottom Layer, 12 vias
v3: diameter 0.81, hole 0.51, Top Layer to Bottom Layer, 4 vias

## Routing (per net, layer and track width the routed paths; a pad name or vN(x,y) marks a point on that pad's centre or on a via; arc(x,y) is an arc through that point)
GND:
  vias: v1(10.44,13.84) v1(10.44,12.57) v1(11.43,20.26) v1(13.08,20.26) v1(16.23,13.84) v1(32.69,34.34) v1(50.95,13.84) v1(50.95,12.57) v1(51.94,20.26) v1(53.59,20.26) v1(56.75,13.84) v1(73.21,34.34)
DC_7V: length 15.8
  Top Layer w1: U2.1 D1.2 25.91,42.68 25.91,42.67
I2C_SCL: length 43.4
  Top Layer w0.254: H7#2.2 6.6,15.62 7.11,15.62 8.51,17.02 23.5,17.02 23.75,17.27 23.75,18.54 23.23,19.06 U1.12 ; U1#2.12 63.74,19.06 64.26,18.54 64.26,17.27 64.01,17.02 49.02,17.02 47.63,15.62 47.12,15.62 H7.2
I2C_SDA: length 38.2
  Top Layer w0.254: H8.1 49.66,18.29 50.42,17.53 63.37,17.53 63.63,17.78 63.63,18.16 63.38,18.41 U1#2.11 ; U1.11 22.86,18.41 23.11,18.16 23.11,17.78 22.86,17.53 9.91,17.53 9.14,18.29 H8#2.1
LDO_5V: length 5
  Top Layer w1: H3.1 34.64,40.31 U2.3
LED_GREEN: length 25.9
  Top Layer w0.254: H5#2.1 8,25.91 8.51,25.4 8.51,22.23 9.07,21.66 U1.5 ; H5.1 48.51,25.91 49.02,25.4 49.02,22.23 49.59,21.66 U1#2.5
LED_RED: length 22.1
  Top Layer w0.254: U1.6 8.58,21.01 8,21.59 8,22.86 7.49,23.37 H6#2.2 ; H6.2 48.01,23.37 48.51,22.86 48.51,21.59 49.09,21.01 U1#2.6
MCO: length 104.6
  Top Layer w0.254: 76.58,19.81 76.61,19.81 v1(76.65,19.77) ; v1(23.75,19.43) 22.82,20.36 U1.14 ; U1#2.14 63.33,20.36 v1(64.26,19.43) ; v1(36.14,19.77) 36.1,19.81 36.07,19.81
  Bottom Layer w0.254: H1.6 63.5,35.94 76.33,35.94 78.23,34.04 78.23,20.19 77.8,19.77 v1(76.65,19.77) 76.61,19.81 70.48,19.81 70.1,19.43 v1(64.26,19.43) ; v1(23.75,19.43) 29.59,19.43 29.97,19.81 36.1,19.81 v1(36.14,19.77) 37.29,19.77 37.72,20.19 37.72,34.04 35.81,35.94 22.99,35.94 H1#2.6
MCU_5V: length 124.8
  Top Layer w0.254: C7#2.2 C8#2.2 14.55,18.86 14.75,19.06 U1.9 ; C7.2 C8.2 55.06,18.86 55.26,19.06 U1#2.9
  Top Layer w0.5: U4#2.1 30.05,31.77 28.66,33.15 17.65,33.15 H1#2.4 ; H4#2.1 6.98,20.83 8.26,19.56 v3(9.4,19.56) 10.1,18.86 C7#2.2 ; C7.2 50.61,18.86 v3(49.91,19.56) 48.77,19.56 47.5,20.83 H4.1 ; U4.1 70.56,31.77 69.18,33.15 58.17,33.15 H1.4
  Bottom Layer w0.5: v3(9.4,19.56) 9.4,31.88 10.67,33.15 14.86,33.15 H1#2.4 16.26,35.81 17.78,37.34 29.12,37.34 H3.2 ; H1.4 55.37,33.15 51.18,33.15 49.91,31.88 v3(49.91,19.56)
NRST: length 74.6
  Top Layer w0.254: v2(17.27,20.32) 16.95,20.64 16.95,21.99 16.63,22.31 U1.4 v1(12.45,22.31) ; 36.2,21.72 36.19,21.72 v1(36.14,21.77) ; v1(52.96,22.31) U1#2.4 57.14,22.31 57.46,21.99 57.46,20.64 v2(57.79,20.32) ; 76.71,21.72 76.7,21.72 v1(76.65,21.77)
  Bottom Layer w0.254: v1(12.45,22.31) 12.45,22.35 11.81,22.99 11.81,31.24 12.32,31.75 H1#2.2 ; H1.2 52.83,31.75 52.32,31.24 52.32,22.99 52.96,22.35 v1(52.96,22.31) ; v1(36.14,21.77) 31.29,21.77 29.85,20.32 v2(17.27,20.32) ; v1(76.65,21.77) 71.8,21.77 70.36,20.32 v2(57.79,20.32)
PERIPHERAL_5V: length 136.6
  Top Layer w0.254: LED2.2 21.12,11.69 21.08,11.73 21,11.81 R4#2.2 ; LED3#2.2 61.61,13.59 61.6,13.57 ; R4.2 61.51,11.81 61.6,11.73 61.63,11.69 LED2#2.2 ; U3#2.8 56.94,14.92 C6#2.1 C5#2.1 ; 21.08,10.18 20.97,10.29 R5.1 ; 61.6,10.18 61.48,10.29 R5#2.1 ; U3.8 16.42,14.92 C6.1 C5.1 ; 21.08,13.57 21.1,13.59 LED3.2
  Top Layer w0.5: C5#2.1 61.15,14.92 61.6,14.48 v3(61.6,9.27) 44.25,9.27 42.04,11.49 42.04,18.42 H4.2 ; C5.1 20.64,14.92 21.08,14.48 v3(21.08,9.27) 3.74,9.27 1.52,11.49 1.52,18.42 H4#2.2
  Bottom Layer w0.5: v3(61.6,9.27) 58.55,6.22 24.13,6.22 v3(21.08,9.27)
PWM_GET/TCLK: length 68.8
  Top Layer w0.254: H1.5 58.79,28.69 58.79,27.06 ; 18.28,27.06 18.25,27.08 12.16,27.08 11.05,28.19 11.05,33.78 9.78,35.05 4.45,35.05 3.94,34.54 H12#2.2 ; 18.28,27.06 18.67,26.67 18.67,20.57 19.53,19.71 U1.13 ; 18.28,27.06 18.28,28.69 H1#2.5 ; 58.79,27.06 59.18,26.67 59.18,20.57 60.05,19.71 U1#2.13 ; 58.79,27.06 58.77,27.08 52.67,27.08 51.56,28.19 51.56,33.78 50.29,35.05 44.96,35.05 44.45,34.54 H12.2
PWM_SEND: length 35.8
  Top Layer w0.254: H12.1 50.29,33.53 50.93,32.89 50.93,24.77 51.43,24.26 U1#2.1 ; H12#2.1 9.78,33.53 10.41,32.89 10.41,24.77 10.92,24.26 U1.1
SPI_MISO/TDO: length 92.9
  Top Layer w0.254: H11.2 44.45,12.45 45.59,11.3 48.39,11.3 49.02,11.94 49.02,15.11 49.91,16 64.77,16 65.66,16.89 65.66,20.32 63.67,22.31 U1#2.17 v1(60.71,22.31) ; v1(20.19,22.31) U1.17 23.16,22.31 25.15,20.32 25.15,16.89 24.26,16 9.4,16 8.51,15.11 8.51,11.94 7.87,11.3 5.08,11.3 3.94,12.45 H11#2.2
  Bottom Layer w0.254: H1#2.1 13.72,27.05 15.11,25.65 16.64,25.65 19.98,22.31 v1(20.19,22.31) ; H1.1 54.23,27.05 55.63,25.65 57.15,25.65 60.49,22.31 v1(60.71,22.31)
SPI_MOSI/TDI: length 90
  Top Layer w0.254: H1#2.3 17.53,30.48 21.97,30.48 22.61,29.85 22.61,28.58 19.61,25.58 19.61,21.92 19.86,21.66 U1.16 22.92,21.66 24.51,20.07 24.51,17.15 23.88,16.51 9.05,16.51 6.48,13.94 H11#2.1 ; H1.3 58.04,30.48 62.48,30.48 63.12,29.85 63.12,28.58 60.12,25.58 60.12,21.92 60.38,21.66 U1#2.16 63.43,21.66 65.02,20.07 65.02,17.15 64.39,16.51 49.56,16.51 46.99,13.94 H11.1
SPI_SCK/TSTROBE: length 22.1
  Top Layer w0.254: H1#2.7 19.15,27.03 19.15,21.74 19.88,21.01 U1.15 ; H1.7 59.66,27.03 59.66,21.74 60.4,21.01 U1#2.15
TAI: length 42.9
  Top Layer w0.254: H1#2.10 26.8,31.75 29.46,29.08 29.46,23.75 27.56,21.84 25.53,21.84 23.76,23.61 U1.19 ; U1#2.19 64.27,23.61 66.04,21.84 68.07,21.84 69.98,23.75 69.98,29.08 67.31,31.75 64.39,31.75
TAO: length 38.4
  Top Layer w0.254: H1#2.8 22.61,30.48 25.02,30.48 28.45,27.05 28.45,24.26 27.94,23.75 H13#2.1 26.29,24.26 U1.20 ; U1#2.20 66.8,24.26 H13.1 68.45,23.75 68.96,24.26 68.96,27.05 65.53,30.48 63.12,30.48 H1.8
UART0_RX: length 74.8
  Top Layer w0.254: 76.71,23.75 v1(76.67,23.75) U4.5 ; v2(17.53,21.08) 17.53,22.33 16.89,22.96 U1.3 9.81,22.96 9.14,23.62 9.14,27.81 8.51,28.45 H10.1 ; 36.2,23.75 v1(36.16,23.75) U4#2.5 ; H10#2.1 49.02,28.45 49.66,27.81 49.66,23.62 50.32,22.96 U1#2.3 57.4,22.96 58.04,22.33 v2(58.04,21.08)
  Bottom Layer w0.254: v1(36.16,23.75) 31.75,23.75 28.7,20.7 17.91,20.7 v2(17.53,21.08) ; v2(58.04,21.08) 58.42,20.7 69.22,20.7 72.26,23.75 v1(76.67,23.75)
UART0_TX: length 79.9
  Top Layer w0.254: H9#2.1 49.78,30.99 50.27,30.51 50.27,24.16 50.8,23.62 56.3,23.62 U1#2.2 57.65,23.61 v2(57.66,23.62) ; v2(17.14,23.62) 17.13,23.61 U1.2 15.79,23.62 10.29,23.62 9.75,24.16 9.75,30.51 9.27,30.99 H9.1 ; 36.2,25.78 36.16,25.78 v1(36.14,25.77) ; 76.71,25.78 76.67,25.78 v1(76.65,25.77)
  Bottom Layer w0.254: v1(76.65,25.77) 73.01,25.77 68.58,21.34 58.8,21.34 57.66,22.48 v2(57.66,23.62) ; v1(36.14,25.77) 32.5,25.77 28.07,21.34 18.29,21.34 17.14,22.48 v2(17.14,23.62)
UART1_RX/SWCLK: length 137.8
  Top Layer w0.254: H9.2 2.29,32.64 2.29,34.67 3.56,35.94 35.81,35.94 37.72,34.04 37.72,28.32 37.16,27.77 U4#2.3 31.83,27.77 30.61,26.54 30.61,23.11 28.45,20.96 25.4,20.96 23.39,22.96 U1.18 ; U1#2.18 63.91,22.96 65.91,20.96 68.96,20.96 71.12,23.11 71.12,26.54 72.34,27.77 U4.3 77.68,27.77 78.23,28.32 78.23,34.04 76.33,35.94 44.07,35.94 42.8,34.67 42.8,32.64 H9#2.2
UART1_TX/SWDIO: length 141.5
  Top Layer w0.254: v2(17.78,25.53) 18.16,25.15 18.16,20.09 17.78,19.71 U1.8 15.77,19.69 v2(14.61,19.69) ; v2(58.29,25.53) 58.67,25.15 58.67,20.09 58.29,19.71 U1#2.8 56.29,19.69 v2(55.12,19.69)
  Bottom Layer w0.254: H10#2.2 41.66,25.65 41.66,11.43 44.32,8.76 46.74,8.76 49.53,11.56 49.53,17.02 50.29,17.78 54.1,17.78 54.74,18.42 54.74,19.3 v2(55.12,19.69) ; v2(58.29,25.53) 58.29,26.04 59.31,27.05 69.6,27.05 72.26,29.72 v2(76.71,29.72) ; v2(17.78,25.53) 17.78,26.04 18.8,27.05 29.08,27.05 31.75,29.72 v2(36.2,29.72) ; v2(14.61,19.69) 14.22,19.3 14.22,18.42 13.59,17.78 9.78,17.78 9.02,17.02 9.02,11.56 6.22,8.76 3.81,8.76 1.14,11.43 1.14,25.65 H10.2
$1N831: length 4.1
  Top Layer w2: 14.94,49.85 15,49.78 D1.1
$1N1246: length 1.5
  Top Layer w0.254: R1.1 30.1,46.78 LED1.2
$1N1959: length 95.4
  Top Layer w0.254: H5.2 41.02,22.48 41.02,10.54 43.58,7.98 66.91,7.98 v1(67.56,8.64) ; H5#2.2 0.51,22.48 0.51,10.54 3.07,7.98 26.39,7.98 v1(27.05,8.64)
  Bottom Layer w0.254: v1(67.56,8.64) 67.56,11.68 v1(67.56,11.68) ; v1(27.05,8.64) 27.05,11.68 v1(27.04,11.68)
$1N1962: length 93.2
  Top Layer w0.254: H6#2.1 0.92,20.35 0.92,11.27 3.73,8.46 25.99,8.46 28.19,10.67 28.19,13.34 27.94,13.59 27.05,13.59 R3.1 ; R3#2.1 67.56,13.59 68.45,13.59 68.71,13.34 68.71,10.67 66.5,8.46 44.24,8.46 41.43,11.27 41.43,20.35 H6.1
$1N1965: length 3.2
  Top Layer w0.254: R2#2.2 64.46,11.68 LED2#2.1 ; R2.2 23.95,11.68 LED2.1
$1N1968: length 3.3
  Top Layer w0.254: R3.2 LED3.1 ; R3#2.2 LED3#2.1
$1N2989: length 42.9
  Top Layer w0.254: R4#2.1 17.28,12.57 U3.6 14.73,12.57 12.83,10.67 4.41,10.67 2.54,12.54 2.54,14.86 3.43,15.75 H7#2.1 ; H7.1 43.94,15.75 43.05,14.86 43.05,12.54 44.93,10.67 53.34,10.67 55.25,12.57 U3#2.6 57.79,12.57 R4.1
$1N3006: length 49.4
  Top Layer w0.254: H8.2 42.67,16.51 42.67,12.17 44.93,9.91 53.72,9.91 55.12,11.3 U3#2.5 57.54,11.3 R5#2.2 ; R5.2 17.03,11.3 U3.5 14.61,11.3 13.21,9.91 4.42,9.91 2.16,12.17 2.16,16.51 H8#2.2

## Copper pours and planes (outline as drawn; the poured copper is in the pictures)
GND on Top Layer: 0,55 79,55 79,0 0,0
GND on Bottom Layer: 0,55 79,55 79,0 0,0

## Text on the board
Top Silkscreen Layer: PT32x007_Fox01_HTOL_Test_2.0 | 澎湃微电子
